# Altium schematic sheet PCB方案验证板  12V5A 60Wascii.SchDoc_2022-06-16.schdoc
size 488 x 247 mm
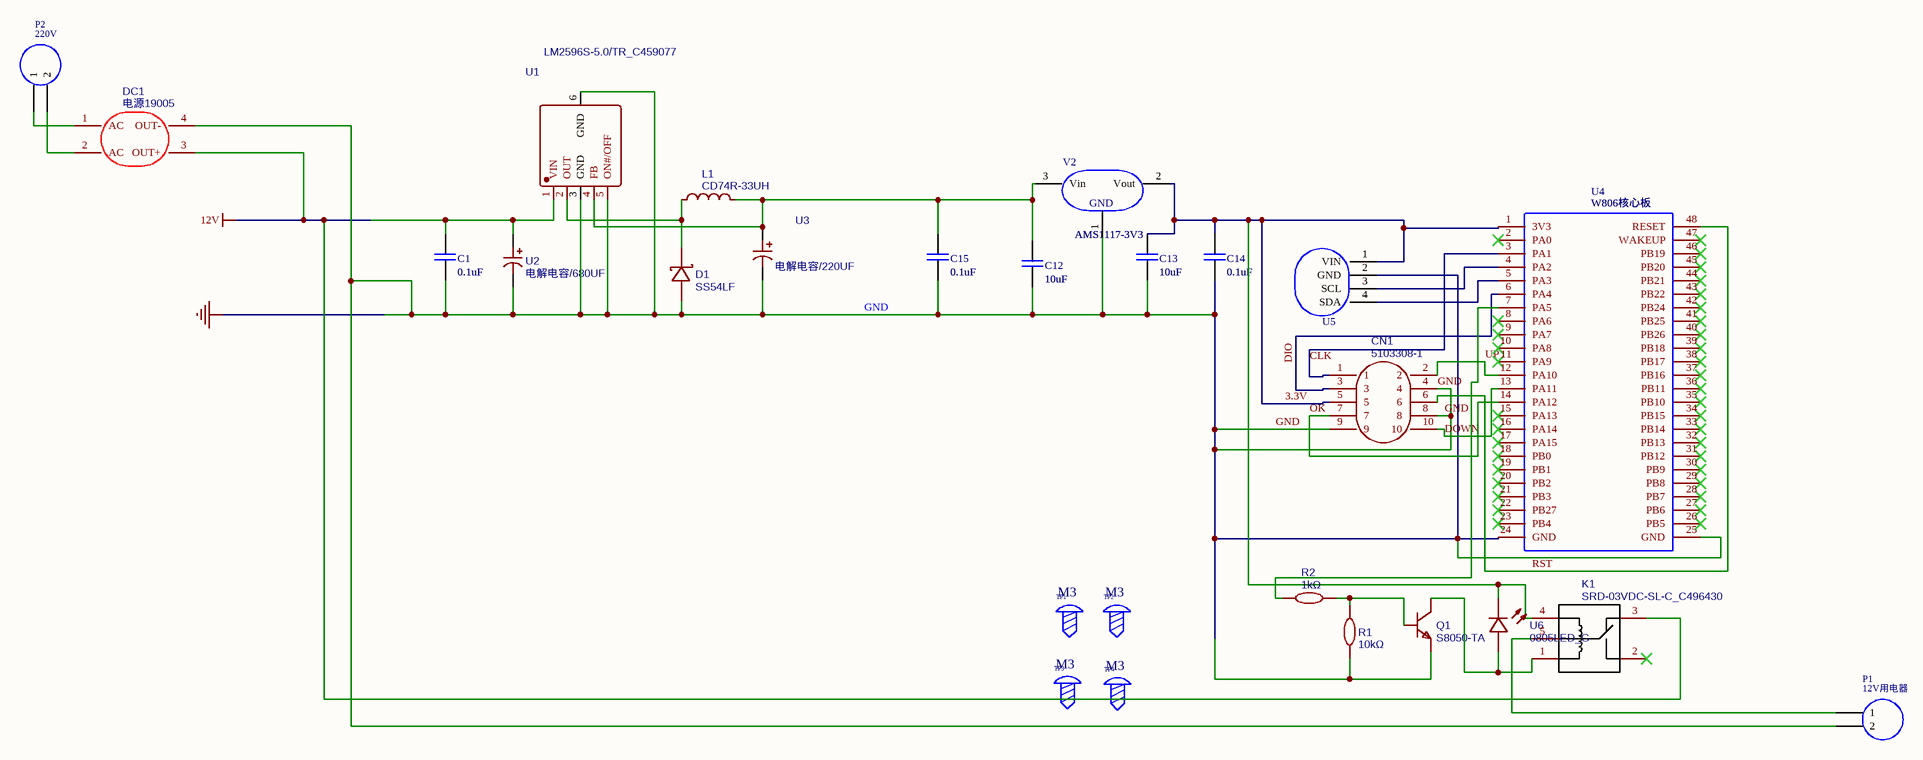
[diagram p0: PCB方案验证板  12V5A 60Wascii.SchDoc_2022-06-16.schdoc]

## Parts
C1  0.1uF  [0805-C]
C12  10uF  [0805-C]
C13  10uF  [0805-C]
C14  0.1uF  [0805-C]
C15  0.1uF  [0805-C]
CN1  5103308-1  [IDC-TH_5103308-1]
D1  SS54LF  [SMAF_L3.5-W2.6-LS4.7-RD]
DC1  电源19005  [电源外购]
K1  SRD-03VDC-SL-C_C496430  [RELAY-TH_SRD-03VDC-SL-C]
L1  CD74R-33UH  [IND-SMD_L7.3-W7.3]
P1  12V用电器  [OUT]
P2  220V  [OUT]
Q1  S8050-TA  [TO-92-3_L4.9-W3.7-P1.27-L]
R1  10kΩ  [R0805]
R2  1kΩ  [R0805]
TP1  NO  [M3X8+6_L]  (value not drawn)
TP2  NO  [M3X8+6_L]  (value not drawn)
TP3  NO  [M3X8+6_L]  (value not drawn)
TP4  NO  [M3X8+6_L]  (value not drawn)
U1  LM2596S-5.0/TR_C459077  [TO-263-5_L10.1-W8.7-P1.70-LS14.4-BR]
U2  电解电容/680UF  [CAP-TH_BD10.0-P5.00-D0.6-FD]
U3  电解电容/220UF  [CAP-TH_BD10.0-P5.00-D0.6-FD]
U4  W806核心板  [W806最小系统]
U5  NO  [AHT10]  (value not drawn)
U6  0805LED_G  [LED-SMD_L2.0-W1.3-R-RD]
V2  AMS1117-3V3  [PG-SOT223-4_L6.5-W3.5-P2.30-LS7.0-BR]

## Nets
12V: C1.2 DC1.3(OUT+) K1.3 U1.1(VIN) U2.1
GND: C1.1 C12.1 C13.1 C14.1 C15.1 CN1.4 CN1.8 CN1.9 D1.2(A) DC1.4(OUT-) P1.GND(2) Q1.1(E) R1.1 U1.3(GND) U1.5(ON#/OFF) U1.6(GND) U2.2 U3.2 U4.24(GND) U4.25(GND) U5.2(GND) V2.1(GND)
3.3V: C13.2 C14.2 CN1.5 K1.4 U4.1(3V3) U5.1(VIN) U6.2(-) V2.2(Vout)
CLK: CN1.1 U4.3(PA1)
DIO: CN1.3 U4.6(PA4)
DOWN: CN1.10 U4.13(PA11)
OK: CN1.7 U4.14(PA12)
RST: CN1.6 U4.48(RESET)
UP: CN1.2 U4.12(PA10)
NetC12_2: C12.2 C15.2 L1.2 U1.4(FB) U3.1 V2.3(Vin)
NetD1_1: D1.1(C) L1.1 U1.2(OUT)
NetDC1_1: DC1.1(AC) P2.VCC(1)
NetDC1_2: DC1.2(AC) P2.GND(2)
NetK1_1: K1.1 Q1.3(C) U6.1(+)
NetK1_5: K1.5 P1.VCC(1)
NetQ1_2: Q1.2(B) R1.2 R2.2
NetR2_1: R2.1 U4.7(PA5)
NetU4_4: U4.4(PA2) U5.3(SCL)
NetU4_5: U4.5(PA3) U5.4(SDA)

Not connected (* = marked no-connect by the designer): K1 2*; U4 2(PA0)* 8(PA6)* 9(PA7)* 10(PA8)* 11(PA9)* 15(PA13)* 16(PA14)* 17(PA15)* 18(PB0)* 19(PB1)* 20(PB2)* 21(PB3)* 22(PB27)* 23(PB4)* 26(PB5)* 27(PB6)* 28(PB7)* 29(PB8)* 30(PB9)* 31(PB12)* 32(PB13)* 33(PB14)* 34(PB15)* 35(PB10)* 36(PB11)* 37(PB16)* 38(PB17)* 39(PB18)* 40(PB26)* 41(PB25)* 42(PB24)* 43(PB22)* 44(PB21)* 45(PB20)* 46(PB19)* 47(WAKEUP)*

## Library data of the parts
C1 C14 C15 = 0.1uF: Symbol: CAP-SMT; Origin Footprint: C 0805_M; Add into BOM: yes; NAME: 2; Name: 0.1uF; Device: CAP-SMT; Convert to PCB: yes; NUMBER: 2
C12 C13 = 10uF: Symbol: CAP-SMT; Origin Footprint: C 0805_M; Add into BOM: yes; NAME: 2; Pin Type: IN; Name: 10uF; Device: CAP-SMT; Convert to PCB: yes; NUMBER: 2
CN1 = 5103308-1: BOM_Manufacturer: TE Connectivity; BOM_Supplier: LCSC; BOM_Manufacturer Part: 5103308-1; BOM_Supplier Part: C86466; BOM_JLCPCB Part Class: Extended Part; spicePre: C; spiceSymbolName: 5103308-1
D1 = SS54LF: BOM_Manufacturer: Jingdao; Contributor: LCSC; BOM_Supplier: LCSC; BOM_Manufacturer Part: SS54LF; BOM_Supplier Part: C128733; BOM_JLCPCB Part Class: Extended Part; spicePre: D; spiceSymbolName: SS54LF
DC1 = 电源19005: Contributor: 66ccff; BOM_Supplier: 爱思电源; BOM_Supplier Part: TB-zwd588888; spicePre: D; spiceSymbolName: 电源19005
K1 = SRD-03VDC-SL-C_C496430: BOM_Manufacturer: 松乐; Contributor: LCSC; BOM_Supplier: LCSC; BOM_Supplier Part: C496430; BOM_Manufacturer Part: SRD-03VDC-SL-C; BOM_JLCPCB Part Class: Extended Part; spicePre: K; spiceSymbolName: SRD-03VDC-SL-C_C496430
L1 = CD74R-33UH: BOM_Manufacturer: null; Contributor: LCSC; BOM_Supplier: LCSC; BOM_Supplier Part: C9900002925; BOM_Manufacturer Part: CD74R-33uH; BOM_JLCPCB Part Class: Extended Part; spicePre: L; spiceSymbolName: CD74R-33UH
P1 = 12V用电器: Symbol: 12V5A; Name: 12VFAN; Convert to PCB: yes; Device: 12V5A; LatestRevisionDate: 17-Jul-2002; LatestRevisionNote: Re-released for DXP Platform.; Publisher: Altium Limited; Add into BOM: yes; Origin Footprint: OUT
P2 = 220V: Symbol: 12V5A; Name: 12VFAN; Convert to PCB: yes; Device: 12V5A; LatestRevisionDate: 17-Jul-2002; LatestRevisionNote: Re-released for DXP Platform.; Publisher: Altium Limited; Add into BOM: yes; Origin Footprint: OUT
Q1 = S8050-TA: BOM_Manufacturer: CJ（江苏长电/长晶）; Contributor: LCSC; BOM_Supplier: LCSC; BOM_Supplier Part: C2910375; BOM_Manufacturer Part: S8050-TA; link: https://atta.szlcsc.com//upload/public/pdf/source/20220119/0D44E6FC062862736907477141101B25.pdf; spicePre: Q; spiceSymbolName: S8050-TA
R1 = 10kΩ: BOM_Manufacturer: Shenzhen Eyang Tech Development; BOM_Manufacturer Part: R0805RXX332XJ08LTB; Resistance (Ohms): 3.3K; nameAlias: Resistance; Contributor: LCSC; BOM_Supplier: LCSC; BOM_Supplier Part: C267254; BOM_JLCPCB Part Class: Extended Part; spicePre: R; spiceSymbolName: R0805RXX332XJ08LTB
R2 = 1kΩ: BOM_Manufacturer: Shenzhen Eyang Tech Development; BOM_Manufacturer Part: R0805RXX332XJ08LTB; Resistance (Ohms): 3.3K; nameAlias: Resistance; Contributor: LCSC; BOM_Supplier: LCSC; BOM_Supplier Part: C267254; BOM_JLCPCB Part Class: Extended Part; spicePre: R; spiceSymbolName: R0805RXX332XJ08LTB
TP1-TP4 = NO: Symbol: M3; Add into BOM: yes; Device: M3; Convert to PCB: yes
U1 = LM2596S-5.0/TR_C459077: BOM_Manufacturer: HGC(Huaguan Semicon); Contributor: LCSC; BOM_Supplier: LCSC; BOM_Supplier Part: C459077; BOM_Manufacturer Part: LM2596S-5.0/TR; BOM_JLCPCB Part Class: Extended Part; spicePre: U; spiceSymbolName: LM2596S-5.0/TR_C459077
U2 = 电解电容/680UF: BOM_Manufacturer: null; BOM_Manufacturer Part: 电解电容/22uF/450V/φ10*17-5.0; Contributor: lcsc; BOM_Supplier: LCSC; BOM_Supplier Part: C9900018858; BOM_JLCPCB Part Class: Extended Part; spicePre: U; spiceSymbolName: 电解电容/22UF/450V/φ10*17-5.0
U3 = 电解电容/220UF: BOM_Manufacturer: null; BOM_Manufacturer Part: 电解电容/22uF/450V/φ10*17-5.0; Contributor: lcsc; BOM_Supplier: LCSC; BOM_Supplier Part: C9900018858; BOM_JLCPCB Part Class: Extended Part; spicePre: U; spiceSymbolName: 电解电容/22UF/450V/φ10*17-5.0
U4 = W806核心板: Convert to PCB: yes; Origin Footprint: W806最小系统板; Symbol: W806核心板; Name: W806核心板; Device: W806核心板; Add into BOM: yes
U5 = NO: Symbol: AHT10温湿度传感器; Convert to PCB: yes; Device: AHT10温湿度传感器; Add into BOM: yes
U6 = 0805LED_G: BOM_Manufacturer: null; Contributor: LCSC; BOM_Supplier: LCSC; BOM_Supplier Part: C9900010436; BOM_Manufacturer Part: 0805LED_G; BOM_JLCPCB Part Class: Extended Part; spicePre: U; spiceSymbolName: 0805LED_G
V2 = AMS1117-3V3: BOM____: 稳压芯片; __Ȩ____: 源创客; Origin Footprint: SOT223_M; Add into BOM: yes; NAME: GND; Symbol: AMS1117; Name: AMS1117-3V3; Device: AMS1117; ѧϰ__Դ: www.ooocke.com; Convert to PCB: yes